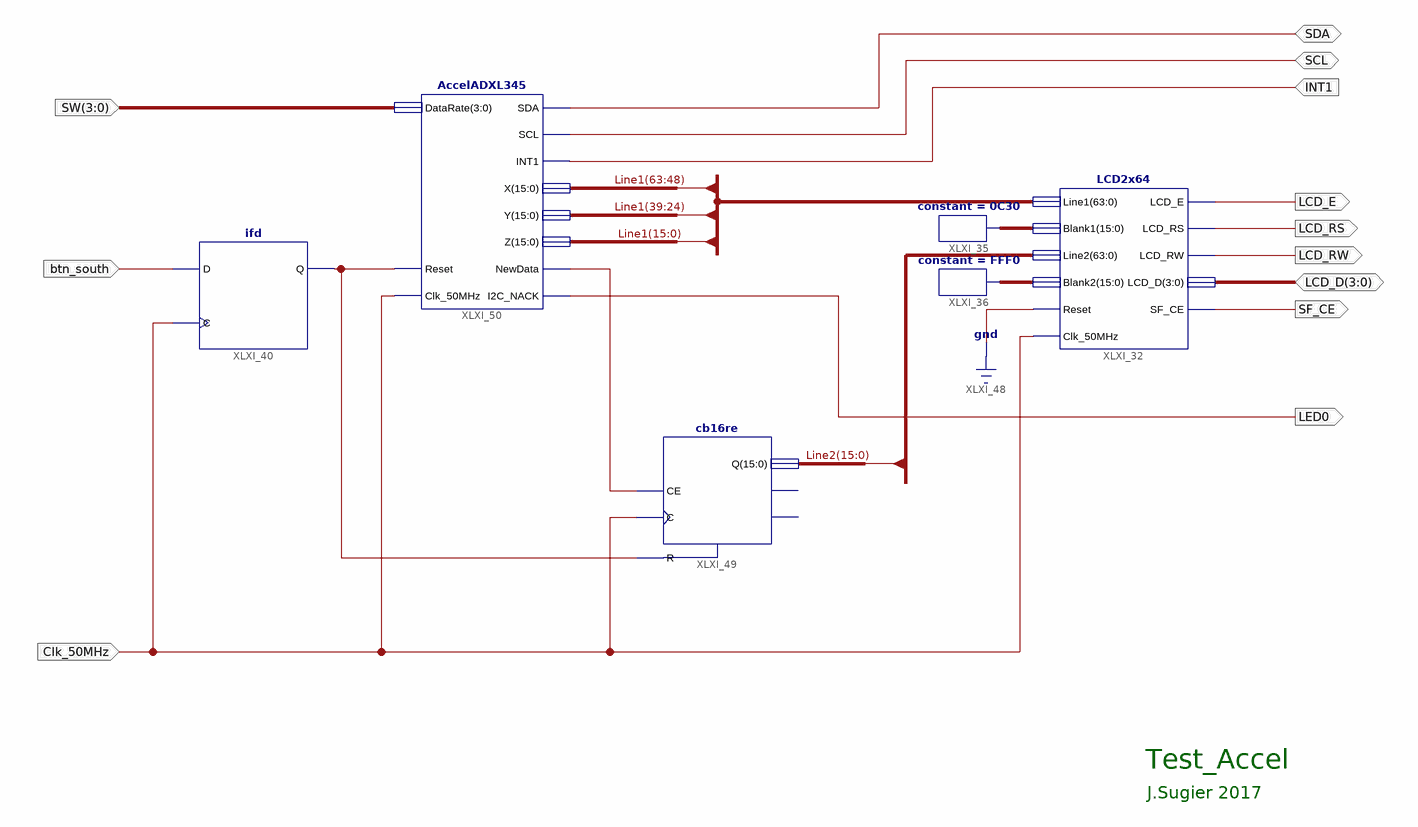
[diagram p0: schematic sheet 1]
// Xilinx ISE schematic top.sch (spartan3e) as structural Verilog: 6 symbols, 12 ports
module top (
  input  btn_south,
  input  [3:0] SW,
  input  INT1,
  input  Clk_50MHz,
  inout  [3:0] LCD_D,
  inout  SDA,
  inout  SCL,
  output LCD_E,
  output SF_CE,
  output LCD_RW,
  output LCD_RS,
  output LED0
);

  wire XLXN_7, XLXN_70;
  wire [15:0] XLXN_23, XLXN_24;
  wire [63:0] Line1, Line2;

  LCD2x64 XLXI_32 (
    .Line1(Line1), .Blank1(XLXN_23), .Line2(Line2), .Blank2(XLXN_24), .LCD_D(LCD_D), .LCD_E(LCD_E),
    .LCD_RW(LCD_RW), .LCD_RS(LCD_RS), .SF_CE(SF_CE), .Reset(1'b0), .Clk_50MHz(Clk_50MHz));
  constant #(.CValue("0C30")) XLXI_35 (.O(XLXN_23));
  constant #(.CValue("FFF0")) XLXI_36 (.O(XLXN_24));
  ifd XLXI_40 (.C(Clk_50MHz), .D(btn_south), .Q(XLXN_70));
  cb16re XLXI_49 (.C(Clk_50MHz), .CE(XLXN_7), .R(XLXN_70), .Q(Line2[15:0]));  // open: CEO, TC
  AccelADXL345 XLXI_50 (
    .SDA(SDA), .SCL(SCL), .INT1(INT1), .X(Line1[63:48]), .Y(Line1[39:24]), .Z(Line1[15:0]), .NewData(XLXN_7),
    .I2C_NACK(LED0), .Clk_50MHz(Clk_50MHz), .Reset(XLXN_70), .DataRate(SW));

  // Notes on the sheet:
  //   Test_Accel
  //   J.Sugier 2017
endmodule
